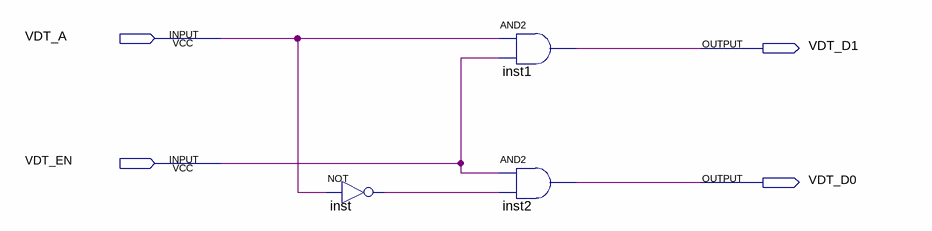
[diagram p0: schematic sheet]
// Quartus schematic assignment1.bdf as structural Verilog: 3 symbols, 4 pins
module assignment1 (
  input  VDT_A,
  input  VDT_EN,
  output VDT_D1,
  output VDT_D0
);

  wire inst_out;

  not inst (inst_out, VDT_A);
  and inst1 (VDT_D1, VDT_A, VDT_EN);
  and inst2 (VDT_D0, VDT_EN, inst_out);
endmodule
